# Altium project cf2loco.PrjPCB
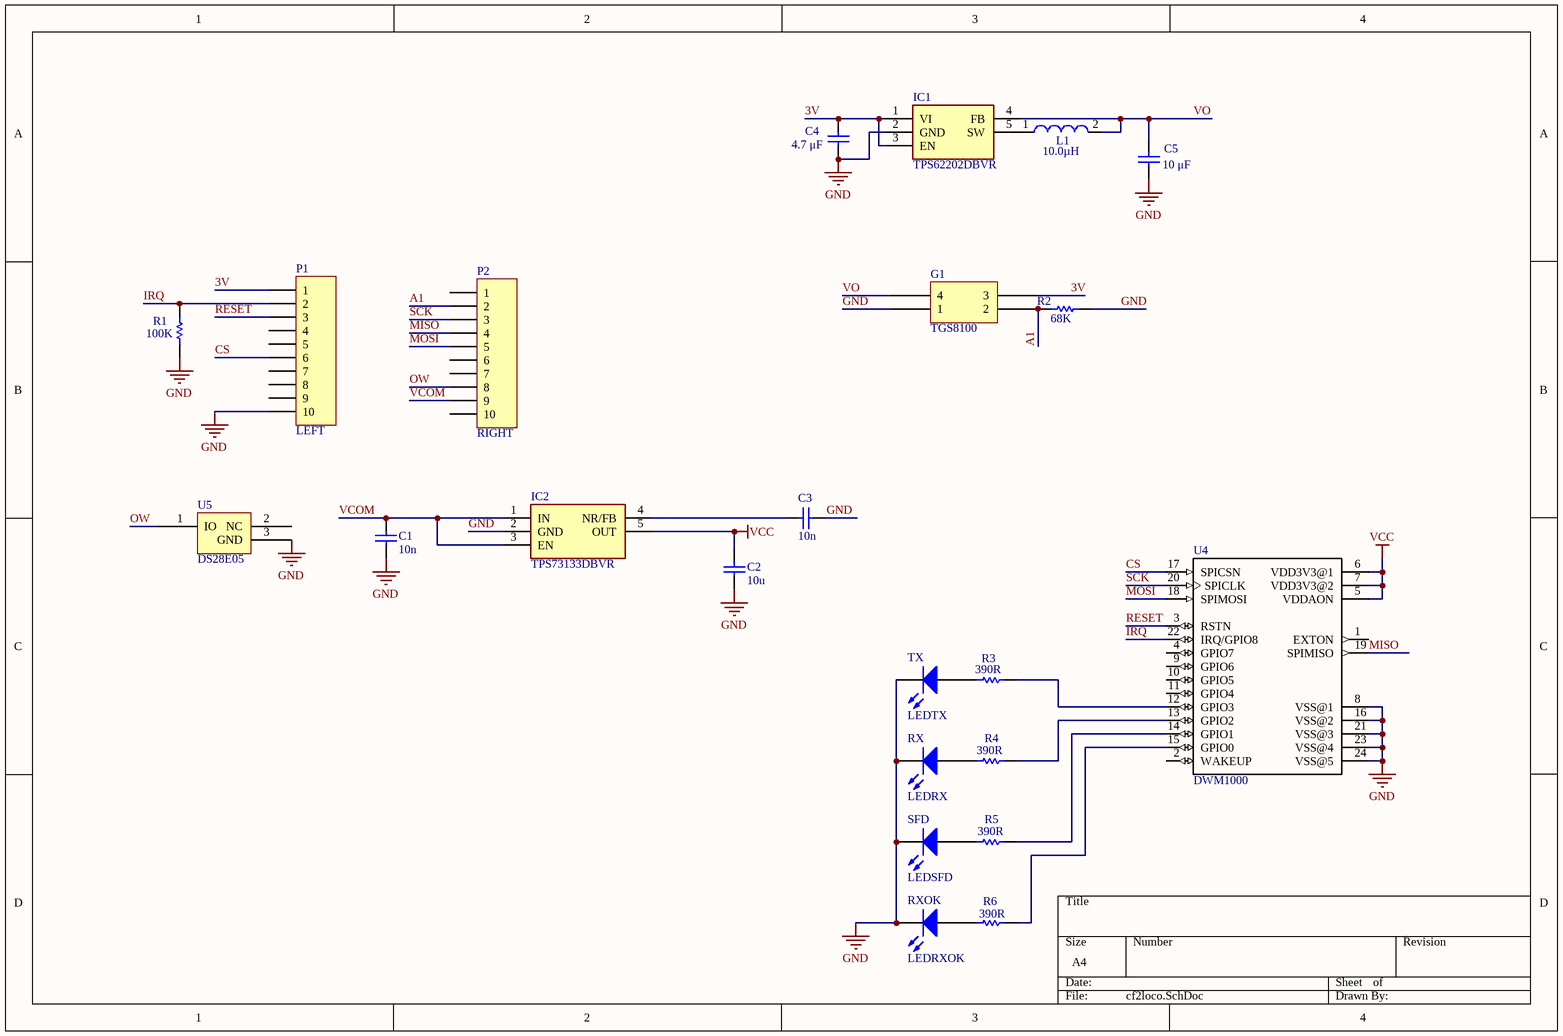
[diagram p0: cf2loco.SchDoc]
1 sheet, 23 parts. Net scope: global (net labels, ports and power ports of the same name join across sheets).
Board file: cf2loco.PcbDoc

## Sheet cf2loco.SchDoc
size A4

### Parts
C1  value 10n  [0402-A]  (hidden comment: Cap)
C2  value 10u  [0603]  (hidden comment: Cap)
C3  value 10n  [0402-A]  (hidden comment: Cap)
C4  Parameter 1: 4.7 μF  [CAPC1608X90X35LL15T15]  (hidden comment: 06036D475KAT2A)
C5  Parameter 1: 10 μF  [CAPC1608X90X35ML15T15]  (hidden comment: 06036D106MAT2A)
G1  TGS8100  [TGS8100]
IC1  TPS62202DBVR  [SOT95P280X145-5N]
IC2  TPS73133DBVR  [SOT95P280X145-5N]
L1  Inductance: 10.0µH  [WE-TPC-3816-S]  (hidden comment: 744031100)
P1  LEFT  [CFHEADER]
P2  RIGHT  [CFHEADER]
R1  Parameter 1: 100K  [RESC2013X50X30NL20T20]  (hidden comment: CRCW0805100KFKEA)
R2  68K  [RESC0603(1608)_M]
R3  Parameter 1: 390R  [RESC2013X50X30NL20T20]  (hidden comment: CRCW0805390RFKEA)
R4  Parameter 1: 390R  [RESC2013X50X30NL20T20]  (hidden comment: CRCW0805390RFKEA)
R5  Parameter 1: 390R  [RESC2013X50X30NL20T20]  (hidden comment: CRCW0805390RFKEA)
R6  Parameter 1: 390R  [RESC2013X50X30NL20T20]  (hidden comment: CRCW0805390RFKEA)
RX  LEDRX  [0402-A]
RXOK  LEDRXOK  [0402-A]
SFD  LEDSFD  [0402-A]
TX  LEDTX  [0402-A]
U4  DWM1000  [DECW-DWM1000-24_V]
U5  DS28E05  [SOT23]

### Nets
GND: C1.1 C2.1 C3.2 C4.1 C5.1 G1.1 IC1.2(GND) IC2.2(GND) P1.10 R1.1 R2.2 RX.2(K) RXOK.2(K) SFD.2(K) TX.2(K) U4.8(VSS@1) U4.16(VSS@2) U4.21(VSS@3) U4.23(VSS@4) U4.24(VSS@5) U5.3(GND)
VCC: C2.2 IC2.5(OUT) U4.5(VDDAON) U4.6(VDD3V3@1) U4.7(VDD3V3@2)
3V: C4.2 G1.3 IC1.1(VI) IC1.3(EN) P1.1
A1: G1.2 P2.2 R2.1
CS: P1.6 U4.17(SPICSN)
IRQ: P1.2 R1.2 U4.22(IRQ/GPIO8)
MISO: P2.4 U4.19(SPIMISO)
MOSI: P2.5 U4.18(SPIMOSI)
OW: P2.8 U5.1(IO)
RESET: P1.3 U4.3(RSTN)
SCK: P2.3 U4.20(SPICLK)
VCOM: C1.2 IC2.1(IN) IC2.3(EN) P2.9
VO: C5.2 G1.4 IC1.4(FB) L1.2
NetC3_1: C3.1 IC2.4(NR/FB)
NetIC1_5: IC1.5(SW) L1.1
NetR3_1: R3.1 TX.1(A)
NetR3_2: R3.2 U4.12(GPIO3)
NetR4_1: R4.1 RX.1(A)
NetR4_2: R4.2 U4.13(GPIO2)
NetR5_1: R5.1 SFD.1(A)
NetR5_2: R5.2 U4.14(GPIO1)
NetR6_1: R6.1 RXOK.1(A)
NetR6_2: R6.2 U4.15(GPIO0)

Not connected (* = marked no-connect by the designer): P1 4 5 7 8 9; P2 1 6 7 10; U4 1(EXTON) 2(WAKEUP) 4(GPIO7) 9(GPIO6) 10(GPIO5) 11(GPIO4); U5 2(NC)

### Library data of the parts
C1-C3 = Cap: Capacitor; Published: 8-Jun-2000; LatestRevisionDate: 17-Jul-2002; LatestRevisionNote: Re-released for DXP Platform.; PackageReference: RAD-0.3; Publisher: Altium Limited; PackageDescription: Radial Cap, Thru-Hole; 2 Leads; 0.3 in Pin Spacing
C4 = CMP-2006-04481-1: Manufacturer: AVX Interconnect / Elco; Part Number: 06036D475KAT2A
C5 = CMP-2006-04476-1: Manufacturer: AVX Interconnect / Elco; Part Number: 06036D106MAT2A
IC1 = TPS62202DBVR: Integrated Circuit; Manufacturer_Name: Texas Instruments; Datasheet Link: http://www.ti.com/lit/gpn/TPS62202; Height: 1.45mm; Manufacturer_Part_Number: TPS62202DBVR
IC2 = TPS73133DBVR: Integrated Circuit; Manufacturer_Name: Texas Instruments; Datasheet Link: http://www.ti.com/lit/gpn/tps731; Height: 1.45mm; Mouser2 Part Number: 595-TPS73133DBVR; Mouser2 Price/Stock: https://www.mouser.com/Search/Refine.aspx?Keyword=595-TPS73133DBVR; Manufacturer_Part_Number: TPS73133DBVR
L1 = CMP-0227-00349-1: SMD Shielded Tiny Power Inductor WE-TPC, L = 10.0 µH; ComponentLink1URL: http://www.we-online.com; PackageReference: WE-TPC-3816-S; ComponentLink1Description: Manufacturer Link; ComponentLink2URL: http://www.we-online.de/katalog/media/pdf/744031100.pdf; PackageVersion: 2009; DatasheetVersion: ver 6, Jan-2009; ComponentLink2Description: Datasheet; PackageDescription: SMD Inductor, 2-Leads, Body 3.8 x 3.8 mm
P1 P2 = Header 10: Header, 10-Pin; LatestRevisionDate: 17-Jul-2002; LatestRevisionNote: Re-released for DXP Platform.; Publisher: Altium Limited
R1 = CMP-2001-04899-1: Manufacturer: Vishay Dale; Part Number: CRCW0805100KFKEA
R2 = CMP-1012-00717-1: 68K 0.1W 1% 0603 (1608 Metric)  SMD; Value: 68000.00 Ohm; Case-EIA: 0603; Case-Metric: 1608; Power: 0.1 W; Technology: SMT; Tolerance: 1 %
R3-R6 = CMP-2001-03859-1: Manufacturer: Vishay Dale; Part Number: CRCW0805390RFKEA
RX RXOK SFD TX = LED2: Typical RED, GREEN, YELLOW, AMBER GaAs LED; Published: 8-Jun-2000; LatestRevisionDate: 17-Jul-2002; LatestRevisionNote: Re-released for DXP Platform.; PackageVersion: Feb-2002; PackageReference: 3.2X1.6X1.1; Publisher: Altium Limited; PackageDescription: SM LED; 2 Flat Leads
U4 = DWM1000: Mod Ieee802.15.4-2011 Uwb Txrx; MF: Decawave; Availability: Good; SnapEDA_Link: https://www.snapeda.com/parts/DWM1000/Decawave/view-part/?ref=snap; Price: 23.04 USD; Package: Module Decawave; MP: DWM1000; Value: *